# Altium project Drum_Water_Op3.PrjPcb (part 1 of 2)
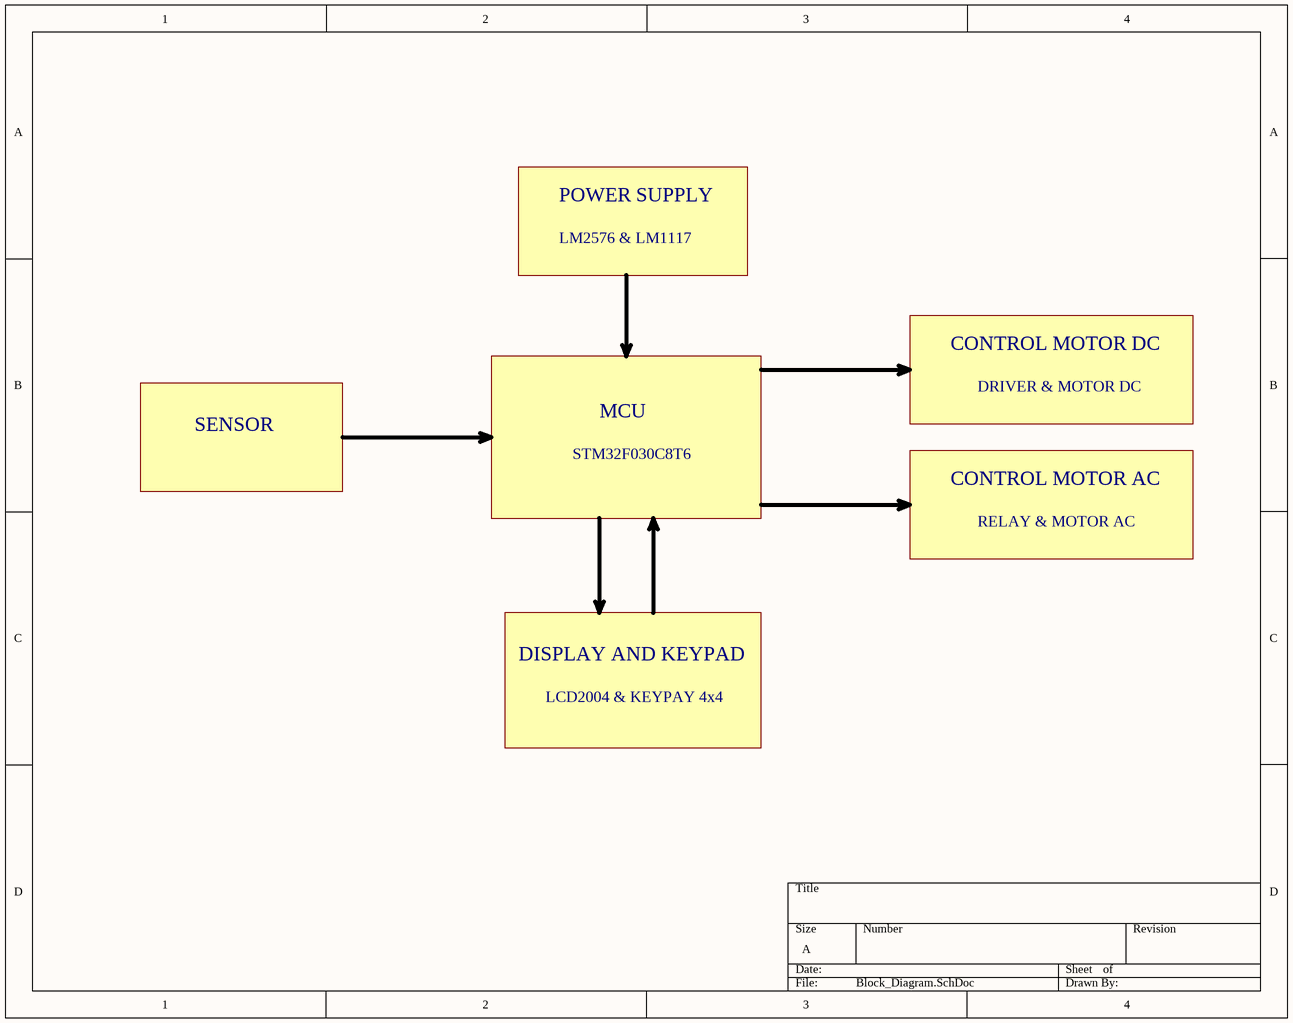
[diagram p0: Block_Diagram.SchDoc]
8 sheets, 145 parts. Net scope: flat (ports and power ports of the same name join across sheets).
Board files: PCB3.PcbDoc, Panel_Drum_Water_Op3.PcbDoc
Sheets:
  Block_Diagram.SchDoc
  Power_Diagram.SchDoc
  MCU.SchDoc
  Input.SchDoc
  Output.SchDoc
  Output_For_Relay.SchDoc
  Power_Supply_AC_to_DC.SchDoc
  Power_Supply.SchDoc

## Sheet Block_Diagram.SchDoc
size A; SheetNumber: 1; SheetTotal: 8

### Notes on the sheet
- POWER SUPPLY
- LM2576 & LM1117
- CONTROL MOTOR DC
- SENSOR
- MCU
- DRIVER & MOTOR DC
- STM32F030C8T6
- CONTROL MOTOR AC
- RELAY & MOTOR AC
- DISPLAY AND KEYPAD
- LCD2004 & KEYPAY 4x4

## Sheet Power_Diagram.SchDoc
size A; SheetNumber: 2; SheetTotal: 8
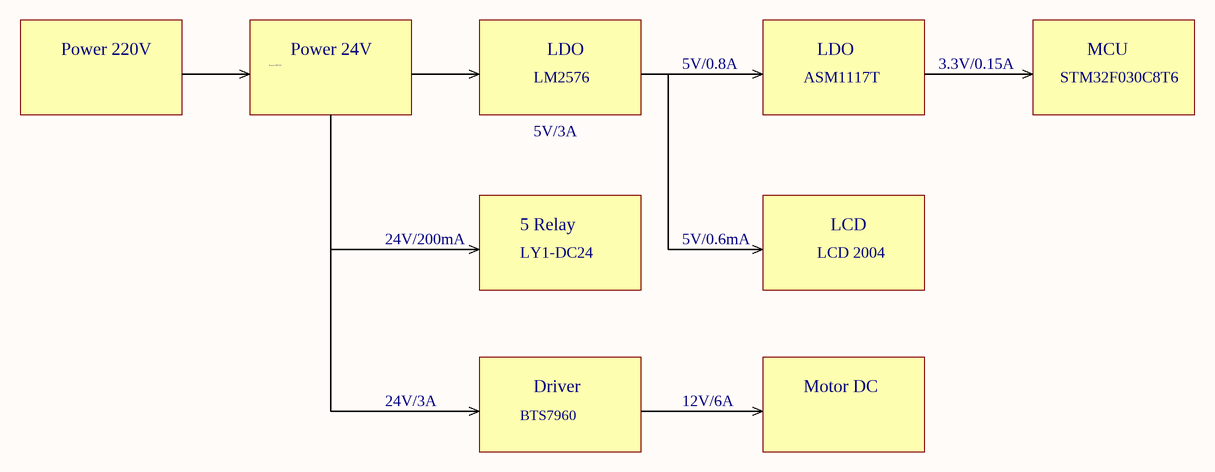
[diagram p1: Power_Diagram.SchDoc]

### Notes on the sheet
- Power 220V
- Power 220VAC
- Power 24V
- LM2576
- LDO
- 5V/0.8A
- ASM1117T
- 3.3V/0.15A
- STM32F030C8T6
- MCU
- 5V/3A
- 24V/200mA
- 5 Relay
- 5V/0.6mA
- LCD
- LY1-DC24
- LCD 2004
- 24V/3A
- BTS7960
- Driver
- 12V/6A
- Motor DC

## Sheet MCU.SchDoc
size A; SheetNumber: 3; SheetTotal: 8
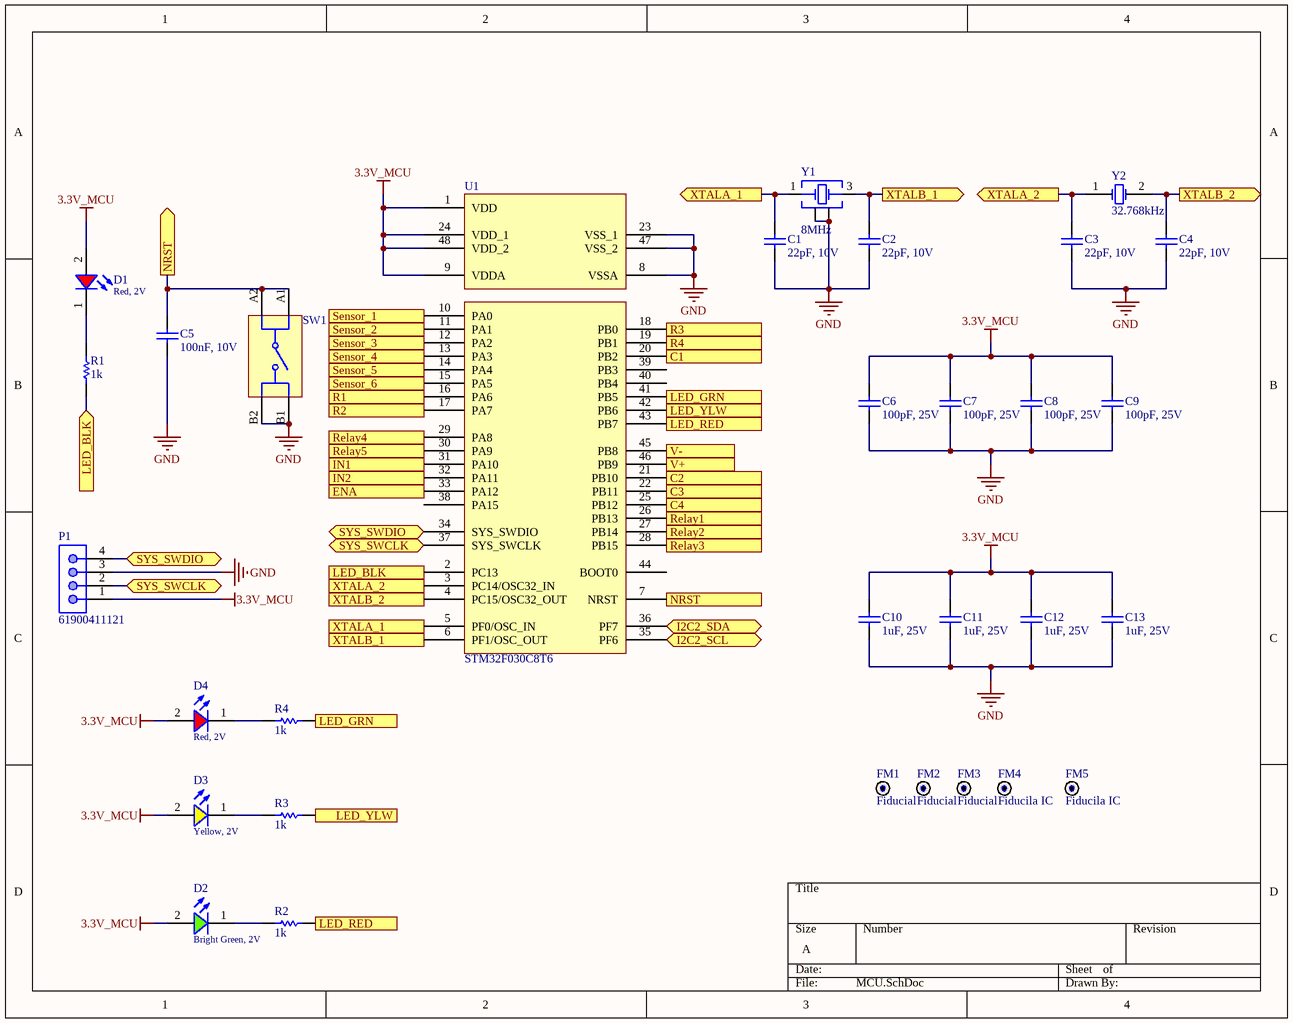
[diagram p2: MCU.SchDoc]

### Parts
C1  22pF, 10V  [WCAP-CSGP_0603_H=0.8mm_Reflow]
C2  22pF, 10V  [WCAP-CSGP_0603_H=0.8mm_Reflow]
C3  22pF, 10V  [WCAP-CSGP_0603_H=0.8mm_Reflow]
C4  22pF, 10V  [WCAP-CSGP_0603_H=0.8mm_Reflow]
C5  100nF, 10V  [WCAP-CSGP_0603_H=0.8mm_Reflow]
C6  100pF, 25V  [WCAP-CSGP_0603_H=0.8mm_Reflow]
C7  100pF, 25V  [WCAP-CSGP_0603_H=0.8mm_Reflow]
C8  100pF, 25V  [WCAP-CSGP_0603_H=0.8mm_Reflow]
C9  100pF, 25V  [WCAP-CSGP_0603_H=0.8mm_Reflow]
C10  1uF, 25V  [WCAP-CSGP_0603_H=0.8mm_Reflow]
C11  1uF, 25V  [WCAP-CSGP_0603_H=0.8mm_Reflow]
C12  1uF, 25V  [WCAP-CSGP_0603_H=0.8mm_Reflow]
C13  1uF, 25V  [WCAP-CSGP_0603_H=0.8mm_Reflow]
D1  Red, 2V  [WL-SMCW_0603_H=0.7mm]
D2  Bright Green, 2V  [WL-SMCW_0603_H=0.7mm]
D3  Yellow, 2V  [WL-SMCW_0603_H=0.7mm]
D4  Red, 2V  [WL-SMCW_0603_H=0.7mm]
FM1  Fiducial  [FUDICIAL_MARKER]  (no BOM)
FM2  Fiducial  [FUDICIAL_MARKER]  (no BOM)
FM3  Fiducial  [FUDICIAL_MARKER]  (no BOM)
FM4  Fiducila IC  [Fiducial Mark IC]  (no BOM)
FM5  Fiducila IC  [Fiducial Mark IC]  (no BOM)
P1  61900411121  [61900411121]
R1  value 1k  [RES-SM-0603]  (hidden comment: ESR03EZPJ102)
R2  value 1k  [RES-SM-0603]  (hidden comment: ESR03EZPJ102)
R3  value 1k  [RES-SM-0603]  (hidden comment: ESR03EZPJ102)
R4  value 1k  [RES-SM-0603]  (hidden comment: ESR03EZPJ102)
SW1  430152050826  [WS-TASV_L6W6H5_4301x20508x6]  (value not drawn)
U1  STM32F030C8T6  [STM32F030C8T6]
Y1  8MHz  [WE-XTAL_CFPX-180]
Y2  32.768kHz  [WE-XTAL_IQXC-90]

### Ports
C1 (in), C2 (in), C3 (in), C4 (in), ENA (out), I2C2_SCL (bidir), I2C2_SDA (bidir), IN1 (out), IN2 (out), LED_BLK (in), LED_BLK (out), LED_GRN (in), LED_GRN (out), LED_RED (in), LED_RED (out), LED_YLW (in), LED_YLW (out), NRST (in), NRST (out), R1 (in), R2 (in), R3 (in), R4 (in), Relay1 (out), Relay2 (out), Relay3 (out), Relay4 (out), Relay5 (out), Sensor_1 (in), Sensor_2 (in), Sensor_3 (in), Sensor_4 (in), Sensor_5 (in), Sensor_6 (in), SYS_SWCLK (bidir), SYS_SWDIO (bidir), V+ (out), V- (out), XTALA_1 (in), XTALA_1 (out), XTALA_2 (in), XTALA_2 (out), XTALB_1 (in), XTALB_1 (out), XTALB_2 (in), XTALB_2 (out)

### Nets
3.3V_MCU: C6.2 C7.2 C8.2 C9.2 C10.2 C11.2 C12.2 C13.2 D1.2(A) D2.2(A) D3.2(A) D4.2(A) P1.1 U1.1(VDD) U1.9(VDDA) U1.24(VDD_1) U1.48(VDD_2)
GND: C1.2 C2.2 C3.2 C4.2 C5.1 C6.1 C7.1 C8.1 C9.1 C10.1 C11.1 C12.1 C13.1 P1.3 SW1.B1 SW1.B2 U1.8(VSSA) U1.23(VSS_1) U1.47(VSS_2) Y1.2(GND&Lid) Y1.4(GND&Lid)
NetC1_1: C1.1 U1.5(PF0/OSC_IN) Y1.1(Crystal) ; port XTALA_1
NetC2_1: C2.1 U1.6(PF1/OSC_OUT) Y1.3(Crystal) ; port XTALB_1
NetC3_1: C3.1 U1.3(PC14/OSC32_IN) Y2.1(OSC1) ; port XTALA_2
NetC4_1: C4.1 U1.4(PC15/OSC32_OUT) Y2.2(OSC2) ; port XTALB_2
NetC5_2: C5.2 SW1.A1 SW1.A2 U1.7(NRST) ; port NRST
NetD1_1: D1.1(K) R1.2
NetD2_1: D2.1(K) R2.2
NetD3_1: D3.1(K) R3.2
NetD4_1: D4.1(K) R4.2
NetD8_2: U1.26(PB13) ; port Relay1
NetD9_2: U1.27(PB14) ; port Relay2
NetD10_2: U1.28(PB15) ; port Relay3
NetD11_2: U1.29(PA8) ; port Relay4
NetD12_2: U1.30(PA9) ; port Relay5
NetJ1_1: U1.16(PA6) ; port R1
NetJ1_2: U1.17(PA7) ; port R2
NetJ1_3: U1.18(PB0) ; port R3
NetJ1_4: U1.19(PB1) ; port R4
NetJ1_5: U1.20(PB2) ; port C1
NetJ1_6: U1.21(PB10) ; port C2
NetJ1_7: U1.22(PB11) ; port C3
NetJ1_8: U1.25(PB12) ; port C4
NetJ2_1: U1.45(PB8) ; port V-
NetJ2_2: U1.10(PA0) ; port Sensor_1
NetJ3_2: U1.11(PA1) ; port Sensor_2
NetJ4_2: U1.12(PA2) ; port Sensor_3
NetJ5_2: U1.13(PA3) ; port Sensor_4
NetJ6_2: U1.14(PA4) ; port Sensor_5
NetJ7_2: U1.15(PA5) ; port Sensor_6
NetJ8_3: U1.35(PF6) ; port I2C2_SCL
NetJ8_4: U1.36(PF7) ; port I2C2_SDA
NetP1_2: P1.2 U1.37(SYS_SWCLK) ; port SYS_SWCLK
NetP1_4: P1.4 U1.34(SYS_SWDIO) ; port SYS_SWDIO
NetP2_1: U1.33(PA12) ; port ENA
NetP2_2: U1.32(PA11) ; port IN2
NetP2_3: U1.31(PA10) ; port IN1
NetR1_1: R1.1 U1.2(PC13) ; port LED_BLK
NetR2_1: R2.1 U1.43(PB7) ; port LED_RED
NetR3_1: R3.1 U1.42(PB6) ; port LED_YLW
NetR4_1: R4.1 U1.41(PB5) ; port LED_GRN
NetR5_2: U1.46(PB9) ; port V+

Not connected (* = marked no-connect by the designer): U1 38(PA15) 39(PB3) 40(PB4) 44(BOOT0)

### Library data of the parts
C1-C4 = 885012006004: WCAP-CSGP Multilayer Ceramic Chip Capacitor, General Purpose, size 0603, NP0, 22pF, 10V; Manufacturer: Wurth Elektronik; Rated Voltage: 10VDC; Isolation Resistance: >=10GOhm; Capacitance Tolerance: +/-5%; Dissipation Factor: Q>=400+20C; Technical Reference: NP00603220J010DFCT10000; No. Pad (SMD): 2; No. Pad (THT): 0; ComponentLink1Description: Manufacturer; ComponentLink1URL: http://www.we-online.de; ComponentLink2Description: Datasheet; ComponentLink2URL: https://www.we-online.com/catalog/datasheet/885012006004.pdf; Operating Temperature: -55 to +125degC; Packaging: Tape and Reel; Manufacturer Part Number: 885012006004; Published Date: May 2020; Ceramic Type: NP0; Height: 0.8mm; Mounting Technology: SMT; Size: 0603; Capacitance: 22pF; Unit Price (Digikey): 0.1
C5 = 885012206020: WCAP-CSGP Multilayer Ceramic Chip Capacitor, General Purpose, size 0603, X7R, 100nF, 10V; Manufacturer: Wurth Elektronik; Rated Voltage: 10VDC; Isolation Resistance: >=5GOhm; Capacitance Tolerance: +/-10%; Technical Reference: X7R0603104K010DFCT10000; No. Pad (SMD): 2; No. Pad (THT): 0; ComponentLink1Description: Manufacturer; ComponentLink1URL: http://www.we-online.de; ComponentLink2Description: Datasheet; ComponentLink2URL: https://www.we-online.com/catalog/datasheet/885012206020.pdf; Operating Temperature: -55 to +125degC; Packaging: Tape and Reel; Manufacturer Part Number: 885012206020; Published Date: May 2020; Ceramic Type: X7R; Dissipation Factor: =<5%; Height: 0.8mm; Mounting Technology: SMT; Size: 0603; Capacitance: 100nF; Unit Price (Digikey): 0.1
C6-C9 = 885012006038: WCAP-CSGP Multilayer Ceramic Chip Capacitor, General Purpose, size 0603, NP0, 100pF, 25V; Manufacturer: Wurth Elektronik; Rated Voltage: 25VDC; Isolation Resistance: >=10GOhm; Capacitance Tolerance: +/-5%; Dissipation Factor: Q>=1000; Technical Reference: NP00603101J025DFCT10000; No. Pad (SMD): 2; No. Pad (THT): 0; ComponentLink1Description: Manufacturer; ComponentLink1URL: http://www.we-online.de; ComponentLink2Description: Datasheet; ComponentLink2URL: https://www.we-online.com/catalog/datasheet/885012006038.pdf; Operating Temperature: -55 to +125degC; Packaging: Tape and Reel; Manufacturer Part Number: 885012006038; Published Date: May 2020; Ceramic Type: NP0; Height: 0.8mm; Mounting Technology: SMT; Size: 0603; Capacitance: 100pF; Unit Price (Digikey): 0.1
C10-C13 = 885012106022: WCAP-CSGP Multilayer Ceramic Chip Capacitor, General Purpose, size 0603, X5R, 1uF, 25V; Manufacturer: Wurth Elektronik; Rated Voltage: 25VDC; Isolation Resistance: >=0.5GOhm; Capacitance Tolerance: +/-20%; Technical Reference: X5R0603105M025DFCT10000; No. Pad (SMD): 2; No. Pad (THT): 0; ComponentLink1Description: Manufacturer; ComponentLink1URL: http://www.we-online.de; ComponentLink2Description: Datasheet; ComponentLink2URL: https://www.we-online.com/catalog/datasheet/885012106022.pdf; Operating Temperature: -55 to +85degC; Packaging: Tape and Reel; Manufacturer Part Number: 885012106022; Published Date: May 2020; Ceramic Type: X5R; Dissipation Factor: =<10%; Height: 0.8mm; Mounting Technology: SMT; Size: 0603; Capacitance: 1uF; Unit Price (Digikey): 0.43
D1 D4 = 150060RS75000: WL-SMCW SMT Mono-color Chip LED Waterclear, size 0603, Red, 2V, 140deg; Chip Technology: AlInGaP; Dominant Wavelength typ.: 625nm; Luminous Intensity typ.: 250mcd; Peak Wavelength typ.: 630nm; No. Pad (SMD): 2; No. Pad (THT): 0; Viewing Angle: 140deg; ComponentLink1Description: Manufacturer; ComponentLink1URL: http://www.we-online.de; ComponentLink2URL: https://www.we-online.com/catalog/datasheet/150060RS75000.pdf; ComponentLink2Description: Datasheet; Forward Voltage typ.: 2V; Emitting Color: Red; Mounting Technology: SMT; Operating Temperature: -40 to +85degC; Published Date: December 2019; Part Number: 150060RS75000; Packaging: Tape and Reel; Size: 0603; Publisher: Wurth Elektronik; Unit Price (Digikey): 0.15
  D4: Parameter 2: *; Parameter 3: *
D2 = 150060VS75000: WL-SMCW SMT Mono-color Chip LED Waterclear, size 0603, Bright Green, 2V, 140deg; Chip Technology: AlInGaP; Dominant Wavelength typ.: 570nm; Luminous Intensity typ.: 40mcd; Peak Wavelength typ.: 572nm; No. Pad (SMD): 2; No. Pad (THT): 0; Viewing Angle: 140deg; ComponentLink1Description: Manufacturer; ComponentLink1URL: http://www.we-online.de; ComponentLink2URL: https://www.we-online.com/catalog/datasheet/150060VS75000.pdf; ComponentLink2Description: Datasheet; Forward Voltage typ.: 2V; Emitting Color: Bright Green; Mounting Technology: SMT; Operating Temperature: -40 to +85degC; Published Date: December 2019; Part Number: 150060VS75000; Packaging: Tape and Reel; Size: 0603; Publisher: Wurth Elektronik; Unit Price (Digikey): 0.15
D3 = 150060YS75000: WL-SMCW SMT Mono-color Chip LED Waterclear, size 0603, Yellow, 2V, 140deg; Chip Technology: AlInGaP; Dominant Wavelength typ.: 590nm; Luminous Intensity typ.: 120mcd; Peak Wavelength typ.: 595nm; No. Pad (SMD): 2; No. Pad (THT): 0; Viewing Angle: 140deg; ComponentLink1Description: Manufacturer; ComponentLink1URL: http://www.we-online.de; ComponentLink2URL: https://www.we-online.com/catalog/datasheet/150060YS75000.pdf; ComponentLink2Description: Datasheet; Forward Voltage typ.: 2V; Emitting Color: Yellow; Mounting Technology: SMT; Operating Temperature: -40 to +85degC; Published Date: December 2019; Part Number: 150060YS75000; Packaging: Tape and Reel; Size: 0603; Publisher: Wurth Elektronik; Unit Price (Digikey): 0.15
P1 = 61900411121: WR-WTB THT Male Vertical Locking Header, pitch 2.54mm, 4p; Pin Number: 4; Contact Resistance: 20mOhm; Rated Current: 3A; Withstanding Voltage: 1000VAC; Working Voltage: 250VAC; No. Pad (SMD): 0; ComponentLink1Description: Manufacturer; ComponentLink1URL: http://www.we-online.de; ComponentLink2Description: Datasheet; ComponentLink2URL: https://www.we-online.com/catalog/datasheet/61900411121.pdf; Pitch: 2.54mm; Published Date: January 2020; Publisher: Wurth Elektronik; Mounting Technology: THT; Packaging: Bag; Operating Temperature: -40 to +105degC; Part Number: 61900411121; Gender: Male; Type: Vertical; No. Pad (THT): 4; Unit Price (Digikey): 0.94
R1-R4 = RESISTOR SMD: RES SMD 1K OHM 5% 1/4W 0603; Mfr: Rohm Semiconductor; Resistance: 1 kOhms; Power (Watts): 0.25W, 1/4W; Temperature Coefficient: ±200ppm/°C; No. Pad (SMD): 2; No. Pad (THT): 0; Category: Resistors; Series: ESR; Tolerance: ±5%; Composition: Thick Film; Features: Automotive AEC-Q200, Pulse Withstanding; Operating Temperature: -55°C ~ 155°C; Package / Case: 0603 (1608 Metric); Supplier Device Package: 0603; Ratings: AEC-Q200; Size / Dimension: 0.063" L x 0.031" W (1.60mm x 0.80mm); Height - Seated (Max): 0.022" (0.55mm); Number of Terminations: 2; Unit Price (Digikey): 0.14
SW1 = 430152050826: WS-TASV SMT Tact Switch, 12VDC, 50mA, 260g, height 5mm; Manufacturer: Wurth Elektronik; Rated Voltage: 12V; Washable: No; Actuator Color: White; Electrical Life: 200000Cycles; No. Pad (SMD): 4; No. Pad (THT): 0; ComponentLink1Description: Manufacturer Link; ComponentLink1URL: http://www.we-online.de; ComponentLink2Description: Datasheet; ComponentLink2URL: https://www.we-online.com/catalog/datasheet/430152050826.pdf; Manufacturer Part Number: 430152050826; Contact Material: Stainless Steel; Mounting Technology: SMT; Contact Plating: Silver; Operation Force: 260g; Packaging: Tape and Reel; Terminal Material: Copper Alloy; Rated Current: 50mA; Terminal Plating: Silver; Height: 5mm; Length: 6mm; Operating Temperature max.: 85C; Operating Temperature min.: -40C; Width: 6mm; Unit Price (Digikey): 0.5
U1 = STM32F030C8T6: / ARM® Cortex®-M0 series Microcontroller IC 32-Bit Single-Core 48MHz 64KB (64K x 8) FLASH 48-LQFP (7x7); Mfr: STMicroelectronics; Connectivity: I²C, SPI, UART/USART; Peripherals: DMA, POR, PWM, WDT; Number of I/O: 39; RAM Size: 8K x 8; Voltage - Supply (Vcc/Vdd): 2.4V ~ 3.6V; Data Converters: A/D 12x12b; Oscillator Type: Internal; No. Pad (SMD): 48; No. Pad (THT): 0; Core Processor: ARM® Cortex®-M0; Core Size: 32-Bit Single-Core; Speed: 48MHz; Program Memory Size: 64KB (64K x 8); Program Memory Type: FLASH; Operating Temperature: -40°C ~ 85°C (TA); Mounting Type: Surface Mount; Supplier Device Package: 48-LQFP (7x7); ComponentLink1Description: Digikey; ComponentLink1URL: https://www.digikey.com/en/products/detail/stmicroelectronics/STM32F030C8T6/4357252; Unit Price (Digikey): 3.25
Y1 = 830108313809: WE-XTAL Quartz Crystal, SMT, CFPX-180, 8MHz, +/-30ppm; Manufacturer: Wurth Elektronik; Frequency Stability: +/-50ppm; Load Capacitance: 12pF; No. Pad (SMD): 4; No. Pad (THT): 0; ComponentLink1Description: Manufacturer; ComponentLink1URL: http://www.we-online.de; ComponentLink2Description: Datasheet; ComponentLink2URL: https://www.we-online.com/catalog/datasheet/830108313809.pdf; Operating Temperature: -40 to +85degC; Packaging: Tape and Reel; Manufacturer Part Number: 830108313809; Published Date: November 2020; Size: CFPX-180; Frequency: 8MHz; Frequency Tolerance: +/-30ppm; Mounting Technology: SMT; Unit Price (Digikey): 0.58
Y2 = 830065253: WE-XTAL Watch Crystal, SMT, IQXC-90, 32.768kHz, +/-20ppm; Manufacturer: Wurth Elektronik; Load Capacitance: 12.5pF; No. Pad (SMD): 2; No. Pad (THT): 0; ComponentLink1Description: Manufacturer; ComponentLink1URL: http://www.we-online.de; ComponentLink2Description: Datasheet; ComponentLink2URL: https://katalog.we-online.com/pbs/datasheet/830065253.pdf; Operating Temperature: -40 to +85degC; Packaging: Tape and Reel; Manufacturer Part Number: 830065253; Published Date: July 2020; Size: IQXC-90; Frequency Stability: -; Frequency: 32.768kHz; Frequency Tolerance: +/-20ppm; Mounting Technology: SMT; Unit Price (Digikey): 1.75

## Sheet Input.SchDoc
size A; SheetNumber: 4; SheetTotal: 8
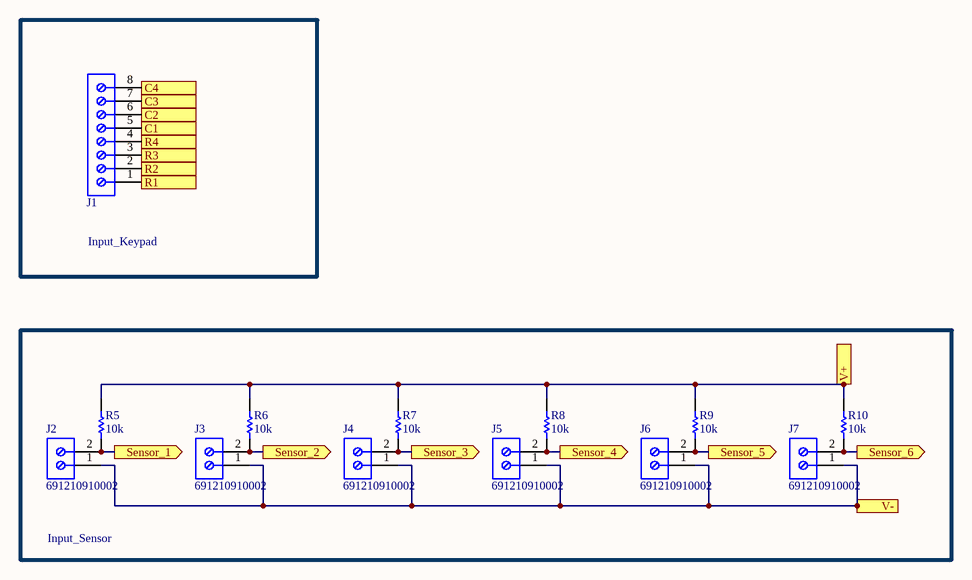
[diagram p3: Input.SchDoc]

### Parts
J1  691210910008  [691210910008]  (value not drawn)
J2  691210910002  [691210910002]
J3  691210910002  [691210910002]
J4  691210910002  [691210910002]
J5  691210910002  [691210910002]
J6  691210910002  [691210910002]
J7  691210910002  [691210910002]
R5  value 10k  [RES-SM-0603]  (hidden comment: ESR03EZPF1002)
R6  value 10k  [RES-SM-0603]  (hidden comment: ESR03EZPF1002)
R7  value 10k  [RES-SM-0603]  (hidden comment: ESR03EZPF1002)
R8  value 10k  [RES-SM-0603]  (hidden comment: ESR03EZPF1002)
R9  value 10k  [RES-SM-0603]  (hidden comment: ESR03EZPF1002)
R10  value 10k  [RES-SM-0603]  (hidden comment: ESR03EZPF1002)

### Blocks framed on the sheet
Input_Keypad: J1
Input_Sensor: J2-J7 R5-R10

### Ports
C1 (out), C2 (out), C3 (out), C4 (out), R1 (out), R2 (out), R3 (out), R4 (out), Sensor_1 (out), Sensor_2 (out), Sensor_3 (out), Sensor_4 (out), Sensor_5 (out), Sensor_6 (out), V+ (in), V- (in)

### Nets
NetJ1_1: J1.1 ; port R1
NetJ1_2: J1.2 ; port R2
NetJ1_3: J1.3 ; port R3
NetJ1_4: J1.4 ; port R4
NetJ1_5: J1.5 ; port C1
NetJ1_6: J1.6 ; port C2
NetJ1_7: J1.7 ; port C3
NetJ1_8: J1.8 ; port C4
NetJ2_1: J2.1 J3.1 J4.1 J5.1 J6.1 J7.1 ; port V-
NetJ2_2: J2.2 R5.1 ; port Sensor_1
NetJ3_2: J3.2 R6.1 ; port Sensor_2
NetJ4_2: J4.2 R7.1 ; port Sensor_3
NetJ5_2: J5.2 R8.1 ; port Sensor_4
NetJ6_2: J6.2 R9.1 ; port Sensor_5
NetJ7_2: J7.2 R10.1 ; port Sensor_6
NetR5_2: R5.2 R6.2 R7.2 R8.2 R9.2 R10.2 ; port V+

### Library data of the parts
J1 = 691210910008: WR-TBL Series 2109 Horizontal Entry, Through Hole, pitch 2.54mm, 8p; Manufacturer: Wurth Elektronik; Pin Number: 8; Rated Current: 6A; Working Voltage: 150V; PCB/Cable/Panel: PCB; Modularity: No; No. Pad (SMD): 0; ComponentLink1Description: Manufacturer Link; ComponentLink1URL: https://www.we-online.com/redexpert/article/691210910008?ad; ComponentLink2Description: Datasheet; ComponentLink2URL: https://www.we-online.com/redexpert/spec/691210910008?ad; Category: Terminal Blocks; Match Code: WR-TBL; Manufacturer Part Number: 691210910008; Mount: Through Hole; Operating Temperature Max: 105°C; Operating Temperature Min: -40°C; Packaging: Box; Pitch: 2.54mm; Orientation: Horizontal; Application: Rising Cage Clamp; No. Pad (THT): 8; Unit Price (Digikey): 3.93
J2-J7 = 691210910002: WR-TBL Serie 2109 Horizontal Entry, Rising Cage Clamp, pitch 2.54mm, 2p; Compliance: Lead free / RoHS; Modularity: No; PCB/Cable/Panel: PCB; Pin Number: 2; Rated Current [UL]: 6A; Working Voltage [UL]: 150VAC; No. Pad (SMD): 0; ComponentLink1Description: Manufacturer; ComponentLink1URL: http://www.we-online.de; ComponentLink2URL: https://katalog.we-online.de/em/datasheet/691210910002.pdf; ComponentLink2Description: Datasheet; Mounting Technology: THT; Part Number: 691210910002; Packaging: Box; Operating Temperature: -40 to +105degC; Pitch: 2.54mm; Published Date: October 2019; Type: Horizontal; Publisher: Wurth Elektronik; Application: Rising Cage Clamp; No. Pad (THT): 2; Unit Price (Digikey): 1.14
R5-R10 = RESISTOR SMD: RES SMD 10K OHM 1% 1/4W 0603; Mfr: Rohm Semiconductor; Resistance: 10 kOhms; Power (Watts): 0.25W, 1/4W; Temperature Coefficient: ±100ppm/°C; No. Pad (SMD): 2; No. Pad (THT): 0; Category: Resistors; Series: ESR; Tolerance: ±1%; Composition: Thick Film; Features: Automotive AEC-Q200, Pulse Withstanding; Operating Temperature: -55°C ~ 155°C; Package / Case: 0603 (1608 Metric); Supplier Device Package: 0603; Ratings: AEC-Q200; Size / Dimension: 0.063" L x 0.031" W (1.60mm x 0.80mm); Height - Seated (Max): 0.022" (0.55mm); Number of Terminations: 2; Unit Price (Digikey): 0.15

## Sheet Output.SchDoc
size A; SheetNumber: 5; SheetTotal: 8
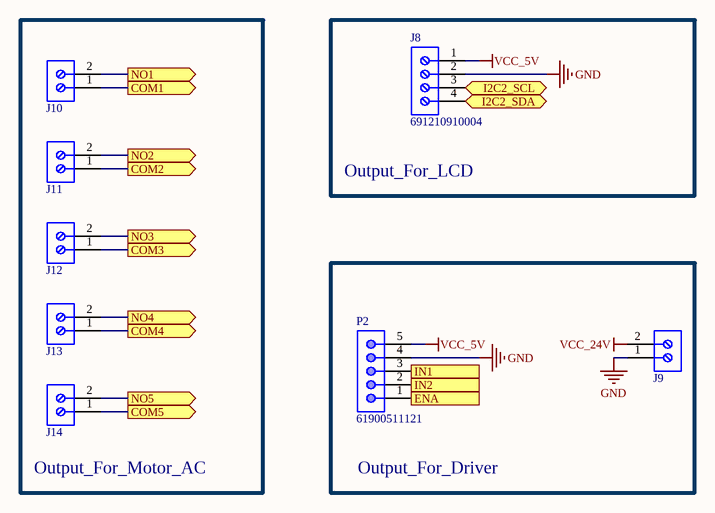
[diagram p4: Output.SchDoc]

### Parts
J8  691210910004  [691210910004]
J9  691137710002  [691137710002]  (value not drawn)
J10  691137710002  [691137710002]  (value not drawn)
J11  691137710002  [691137710002]  (value not drawn)
J12  691137710002  [691137710002]  (value not drawn)
J13  691137710002  [691137710002]  (value not drawn)
J14  691137710002  [691137710002]  (value not drawn)
P2  61900511121  [61900511121]

### Blocks framed on the sheet
Output_For_Motor_AC: J10-J14
Output_For_LCD: J8
Output_For_Driver: J9 P2

### Ports
COM1 (out), COM2 (out), COM3 (out), COM4 (out), COM5 (out), ENA (in), I2C2_SCL (bidir), I2C2_SDA (bidir), IN1 (in), IN2 (in), NO1 (out), NO2 (out), NO3 (out), NO4 (out), NO5 (out)

### Nets
GND: J8.2 J9.1 P2.4
VCC_5V: J8.1 P2.5
VCC_24V: J9.2
NetJ8_3: J8.3 ; port I2C2_SCL
NetJ8_4: J8.4 ; port I2C2_SDA
NetJ10_1: J10.1 ; port COM1
NetJ10_2: J10.2 ; port NO1
NetJ11_1: J11.1 ; port COM2
NetJ11_2: J11.2 ; port NO2
NetJ12_1: J12.1 ; port COM3
NetJ12_2: J12.2 ; port NO3
NetJ13_1: J13.1 ; port COM4
NetJ13_2: J13.2 ; port NO4
NetJ14_1: J14.1 ; port COM5
NetJ14_2: J14.2 ; port NO5
NetP2_1: P2.1 ; port ENA
NetP2_2: P2.2 ; port IN2
NetP2_3: P2.3 ; port IN1

### Library data of the parts
J8 = 691210910004: WR-TBL Serie 2109 Horizontal Entry, Rising Cage Clamp, pitch 2.54mm, 4p; Compliance: Lead free / RoHS; Modularity: No; PCB/Cable/Panel: PCB; Pin Number: 4; Rated Current [UL]: 6A; Working Voltage [UL]: 150VAC; No. Pad (SMD): 0; ComponentLink1Description: Manufacturer; ComponentLink1URL: http://www.we-online.de; ComponentLink2URL: https://katalog.we-online.de/em/datasheet/691210910004.pdf; ComponentLink2Description: Datasheet; Mounting Technology: THT; Part Number: 691210910004; Packaging: Box; Operating Temperature: -40 to +105degC; Pitch: 2.54mm; Published Date: October 2019; Type: Horizontal; Publisher: Wurth Elektronik; Application: Rising Cage Clamp; No. Pad (THT): 4; Unit Price (Digikey): 1.96
J9-J14 = 691137710002: WR-TBL Series 1377 Horizontal Entry, Through Hole, pitch 5mm, 2p; Manufacturer: Wurth Elektronik; Pin Number: 2; Rated Current: 16A; Working Voltage: 300V; PCB/Cable/Panel: PCB; Modularity: No; No. Pad (SMD): 0; ComponentLink1Description: Manufacturer Link; ComponentLink1URL: https://www.we-online.com/redexpert/article/691137710002?ad; ComponentLink2Description: Datasheet; ComponentLink2URL: https://www.we-online.com/redexpert/spec/691137710002?ad; Category: Terminal Blocks; Match Code: WR-TBL; Manufacturer Part Number: 691137710002; Mount: Through Hole; Operating Temperature Max: 120°C; Operating Temperature Min: -30°C; Packaging: Box; Pitch: 5mm; Orientation: Horizontal; Application: Pressure Clamp; No. Pad (THT): 2; Unit Price (Digikey): 0.41
P2 = 61900511121: WR-WTB THT Male Vertical Locking Header, pitch 2.54mm, 5p; Pin Number: 5; Contact Resistance: 20mOhm; Rated Current: 3A; Withstanding Voltage: 1000VAC; Working Voltage: 250VAC; No. Pad (SMD): 0; ComponentLink1Description: Manufacturer; ComponentLink1URL: http://www.we-online.de; ComponentLink2Description: Datasheet; ComponentLink2URL: https://www.we-online.com/catalog/datasheet/61900511121.pdf; Pitch: 2.54mm; Published Date: January 2020; Publisher: Wurth Elektronik; Mounting Technology: THT; Packaging: Bag; Operating Temperature: -40 to +105degC; Part Number: 61900511121; Gender: Male; Type: Vertical; No. Pad (THT): 5; Unit Price (Digikey): 1.22

## Sheet Output_For_Relay.SchDoc
size A; SheetNumber: 6; SheetTotal: 8
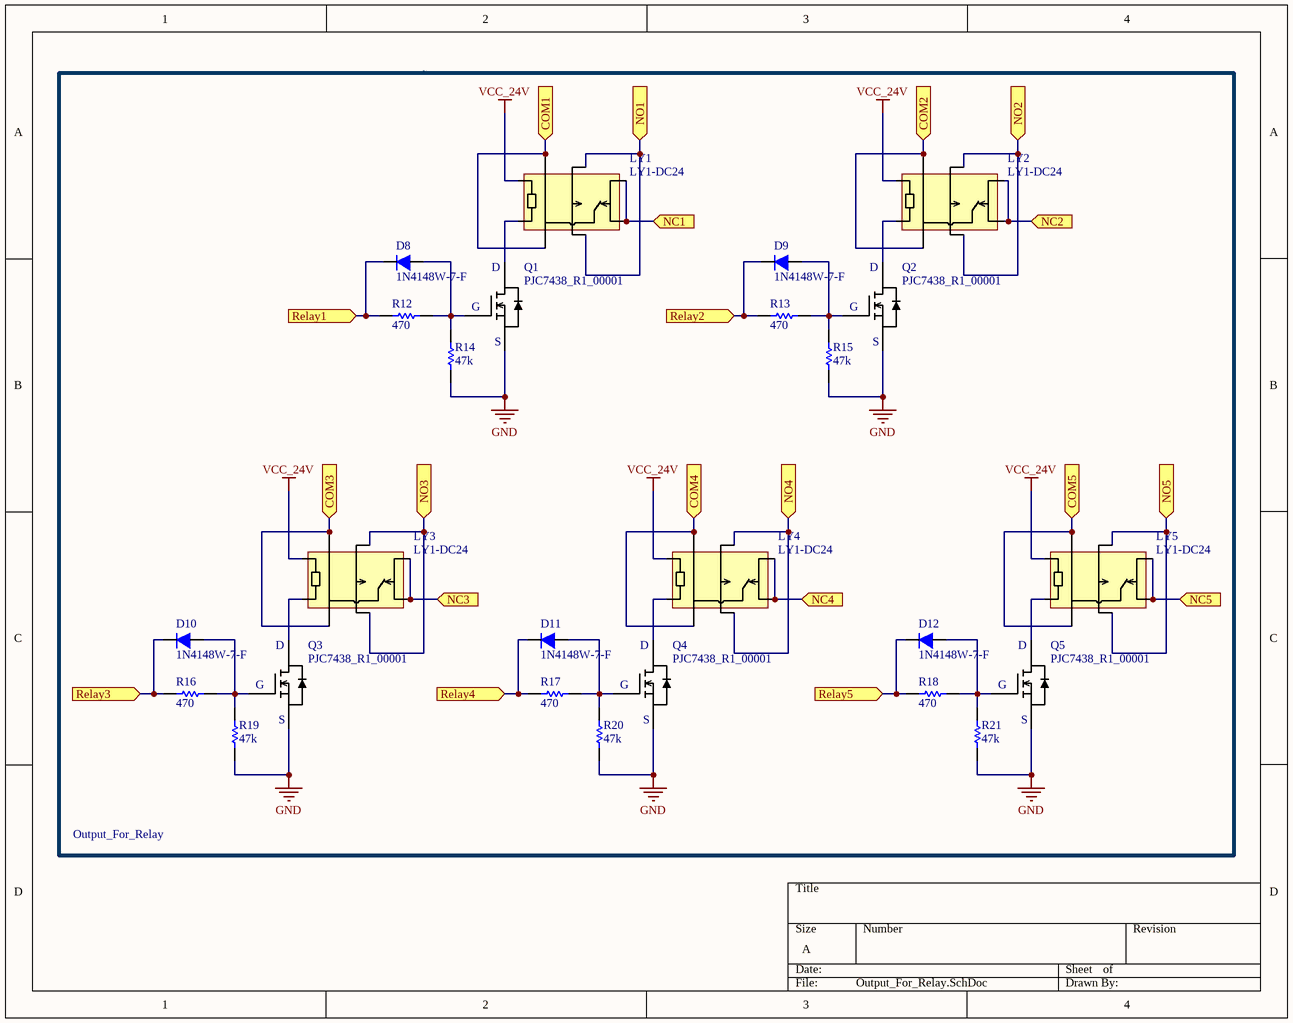
[diagram p5: Output_For_Relay.SchDoc]

### Parts
D8  1N4148W-7-F  [1N4148]
D9  1N4148W-7-F  [1N4148]
D10  1N4148W-7-F  [1N4148]
D11  1N4148W-7-F  [1N4148]
D12  1N4148W-7-F  [1N4148]
LY1  LY1-DC24  [LY1-DC24]
LY2  LY1-DC24  [LY1-DC24]
LY3  LY1-DC24  [LY1-DC24]
LY4  LY1-DC24  [LY1-DC24]
LY5  LY1-DC24  [LY1-DC24]
Q1  PJC7438_R1_00001  [PJC7438]
Q2  PJC7438_R1_00001  [PJC7438]
Q3  PJC7438_R1_00001  [PJC7438]
Q4  PJC7438_R1_00001  [PJC7438]
Q5  PJC7438_R1_00001  [PJC7438]
R12  value 470  [RES-SM-0603]  (hidden comment: ESR03EZPJ471)
R13  value 470  [RES-SM-0603]  (hidden comment: ESR03EZPJ471)
R14  value 47k  [RES-SM-0603]  (hidden comment: ESR03EZPJ473)
R15  value 47k  [RES-SM-0603]  (hidden comment: ESR03EZPJ473)
R16  value 470  [RES-SM-0603]  (hidden comment: ESR03EZPJ471)
R17  value 470  [RES-SM-0603]  (hidden comment: ESR03EZPJ471)
R18  value 470  [RES-SM-0603]  (hidden comment: ESR03EZPJ471)
R19  value 47k  [RES-SM-0603]  (hidden comment: ESR03EZPJ473)
R20  value 47k  [RES-SM-0603]  (hidden comment: ESR03EZPJ473)
R21  value 47k  [RES-SM-0603]  (hidden comment: ESR03EZPJ473)

### Blocks framed on the sheet
Output_For_Relay: D8-D12 LY1-LY5 Q1-Q5 R12-R21

### Ports
COM1 (in), COM2 (in), COM3 (in), COM4 (in), COM5 (in), NC1 (in), NC2 (in), NC3 (in), NC4 (in), NC5 (in), NO1 (in), NO2 (in), NO3 (in), NO4 (in), NO5 (in), Relay1 (in), Relay2 (in), Relay3 (in), Relay4 (in), Relay5 (in)

### Nets
GND: Q1.2(S) Q2.2(S) Q3.2(S) Q4.2(S) Q5.2(S) R14.2 R15.2 R19.2 R20.2 R21.2
VCC_24V: LY1.7 LY2.7 LY3.7 LY4.7 LY5.7
NetD8_1: D8.1(A) Q1.1(G) R12.1 R14.1
NetD8_2: D8.2(K) R12.2 ; port Relay1
NetD9_1: D9.1(A) Q2.1(G) R13.1 R15.1
NetD9_2: D9.2(K) R13.2 ; port Relay2
NetD10_1: D10.1(A) Q3.1(G) R16.1 R19.1
NetD10_2: D10.2(K) R16.2 ; port Relay3
NetD11_1: D11.1(A) Q4.1(G) R17.1 R20.1
NetD11_2: D11.2(K) R17.2 ; port Relay4
NetD12_1: D12.1(A) Q5.1(G) R18.1 R21.1
NetD12_2: D12.2(K) R18.2 ; port Relay5
NetJ10_1: LY1.5 LY1.6 ; port COM1
NetJ10_2: LY1.3 LY1.4 ; port NO1
NetJ11_1: LY2.5 LY2.6 ; port COM2
NetJ11_2: LY2.3 LY2.4 ; port NO2
NetJ12_1: LY3.5 LY3.6 ; port COM3
NetJ12_2: LY3.3 LY3.4 ; port NO3
NetJ13_1: LY4.5 LY4.6 ; port COM4
NetJ13_2: LY4.3 LY4.4 ; port NO4
NetJ14_1: LY5.5 LY5.6 ; port COM5
NetJ14_2: LY5.3 LY5.4 ; port NO5
NetLY1_1: LY1.1 LY1.2 ; port NC1
NetLY1_8: LY1.8 Q1.3(D)
NetLY2_1: LY2.1 LY2.2 ; port NC2
NetLY2_8: LY2.8 Q2.3(D)
NetLY3_1: LY3.1 LY3.2 ; port NC3
NetLY3_8: LY3.8 Q3.3(D)
NetLY4_1: LY4.1 LY4.2 ; port NC4
NetLY4_8: LY4.8 Q4.3(D)
NetLY5_1: LY5.1 LY5.2 ; port NC5
NetLY5_8: LY5.8 Q5.3(D)

### Library data of the parts
D8-D12 = 1N4148: Diode Standard 100 V 300mA (DC) Surface Mount SOD-123; Mfr: Diodes Incorporated; Voltage - DC Reverse (Vr) (Max): 100 V; Voltage - Forward (Vf) (Max) @ If: 1.25 V @ 150 mA; Speed: Small Signal =< 200mA (Io), Any Speed; Reverse Recovery Time (trr): 4 ns; Current - Reverse Leakage @ Vr: 1 µA @ 100 V; Capacitance @ Vr, F: 2pF @ 0V, 1MHz; No. Pad (SMD): 2; No. Pad (THT): 0; ComponentLink1Description: New link; ComponentLink1URL: https://www.digikey.com/en/products/detail/diodes-incorporated/1N4148W-7-F/814371; Diode Type: Standard; Current - Average Rectified (Io): 300mA (DC); Mounting Type: Surface Mount; Unit Price (Digikey): 0.18
LY1-LY5 = LY1-DC24: General Purpose Relay SPDT (1 Form C) 24VDC Coil Socketable; Mfr: Omron Automation and Safety; Contact Rating (Current): 15 A; Switching Voltage: 250VAC, 125VDC - Max; Coil Current: 36.9 mA; Coil Type: Non Latching; Must Operate Voltage: 19.2 VDC; Must Release Voltage: 2.4 VDC; Operate Time: 25 ms; Coil Resistance: 650 Ohms; No. Pad (SMD): 0; No. Pad (THT): 8; ComponentLink1URL: https://www.digikey.com/en/products/detail/omron-automation-and-safety/LY1-DC24/126843?s=N4IgTCBcDaIDIE0CMBaAIgYTAFhAXQF8g; Mounting Type: Socketable; Coil Voltage: 24VDC; Contact Form: SPDT (1 Form C); Termination Style: Plug In; Release Time: 25 ms; Operating Temperature: -25°C ~ 55°C; Unit Price (Digikey): 11.86
  LY1: ComponentLink1Description: Digikey
  LY2-LY5: ComponentLink1Description: New link
Q1-Q5 = PJC7438: N-Channel 50 V 400mA (Ta) 350mW (Ta) Surface Mount SOT-323; Mfr: Panjit International Inc.; Drain to Source Voltage (Vdss): 50 V; Drive Voltage (Max Rds On, Min Rds On): 1.8V, 10V; Rds On (Max) @ Id, Vgs: 1.45Ohm @ 500mA, 10V; Vgs(th) (Max) @ Id: 1V @ 250µA; Gate Charge (Qg) (Max) @ Vgs: 0.95 nC @ 4.5 V; Vgs (Max): ±20V; Input Capacitance (Ciss) (Max) @ Vds: 36 pF @ 25 V; No. Pad (SMD): 3; No. Pad (THT): 0; ComponentLink1Description: New link; ComponentLink1URL: https://www.panjit.com.tw/upload/datasheet/PJC7438.pdf; FET Type: N-Channel; Technology: MOSFET (Metal Oxide); Current - Continuous Drain (Id) @ 25°C: 400mA (Ta); Power Dissipation (Max): 350mW (Ta); Operating Temperature: -55°C ~ 150°C (TJ); Mounting Type: Surface Mount; Package / Case: SC-70, SOT-323; Unit Price (Digikey): 0.47
R12 R13 R16-R18 = RESISTOR SMD: RES SMD 470 OHM 5% 1/4W 0603; Mfr: Rohm Semiconductor; Resistance: 470 Ohms; Power (Watts): 0.25W, 1/4W; Temperature Coefficient: ±200ppm/°C; No. Pad (SMD): 2; No. Pad (THT): 0; Category: Resistors; Series: ESR; Tolerance: ±5%; Composition: Thick Film; Features: Automotive AEC-Q200, Pulse Withstanding; Operating Temperature: -55°C ~ 155°C; Package / Case: 0603 (1608 Metric); Supplier Device Package: 0603; Ratings: AEC-Q200; Size / Dimension: 0.063" L x 0.031" W (1.60mm x 0.80mm); Height - Seated (Max): 0.022" (0.55mm); Number of Terminations: 2; Unit Price (Digikey): 0.14
R14 R15 R19-R21 = RESISTOR SMD: RES SMD 47K OHM 5% 1/4W 0603; Mfr: Rohm Semiconductor; Resistance: 47 kOhms; Power (Watts): 0.25W, 1/4W; Temperature Coefficient: ±200ppm/°C; No. Pad (SMD): 2; No. Pad (THT): 0; Category: Resistors; Series: ESR; Tolerance: ±5%; Composition: Thick Film; Features: Automotive AEC-Q200, Pulse Withstanding; Operating Temperature: -55°C ~ 155°C; Package / Case: 0603 (1608 Metric); Supplier Device Package: 0603; Ratings: AEC-Q200; Size / Dimension: 0.063" L x 0.031" W (1.60mm x 0.80mm); Height - Seated (Max): 0.022" (0.55mm); Number of Terminations: 2; Unit Price (Digikey): 0.14
  R15: ComponentLink1Description: New link; ComponentLink1URL: *